# EAGLE design Trailer Wireup (EAGLE 9.6.2)
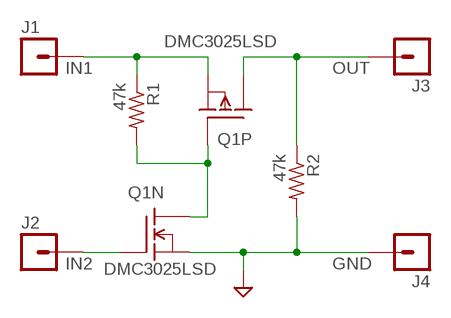
[diagram p0: schematic, sheet 1]

## Parts
J1  CONN-1-SCREW-#6-0.3IN  [SCREW_TERMINAL-#6-0.3IN]
J2  CONN-1-SCREW-#6-0.3IN  [SCREW_TERMINAL-#6-0.3IN]
J3  CONN-1-SCREW-#6-0.3IN  [SCREW_TERMINAL-#6-0.3IN]
J4  CONN-1-SCREW-#6-0.3IN  [SCREW_TERMINAL-#6-0.3IN]
Q1  DMC3025LSD  [SO8]
R1  47k  R-US0603  [0603]
R2  47k  R-US0603  [0603]

## Nets
GND: J4.1 Q1.1(N:S) R2.2
IN1: J1.1 Q1.3(P:S) R1.1
IN2: J2.1 Q1.2(N:G)
N$1: Q1.4(P:G) Q1.7(N:D) Q1.8(N:D) R1.2
OUT: J3.1 Q1.5(P:D) Q1.6(P:D) R2.1

## Library data of the parts
J1-J4 = Connectors:CONN-1
Q1 = Tim's Parts:DMC3025LSD
R1 R2 = Tim's Parts:R-US: RESISTOR, American symbol

## Board
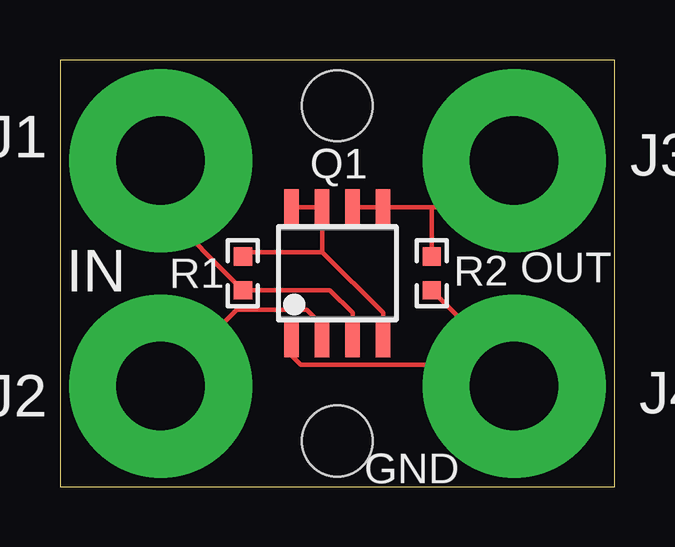
[diagram p1: board, top side]
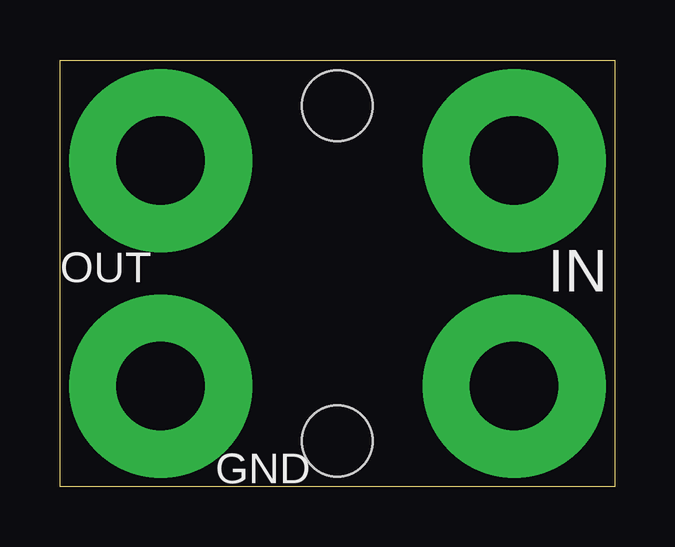
[diagram p2: board, bottom side, seen from below]

Size 23.11 x 17.78 mm. Coordinates in mm from the lower left corner, seen from the top.
Outline: 0,0 23.11,0 23.11,17.78 0,17.78 0,0
Copper layers (1*16): Top 0.035559375mm / dielectric 1.6mm / Bottom 0.035559375mm
Design rules "oshpark-2layer": minimum track width 6mil, minimum drill 10mil, track to track 6mil, track to pad 6mil, pad to pad 6mil, via to via 6mil, smd to smd 0mil, copper to edge 15mil, drill to drill 6mil, minimum pad ring 5mil, minimum via ring 5mil, stop-mask expansion 2.5mil, vias tented up to drill 0mil, thermal gap 6mil
Holes 2.95 mm at 11.56,15.88 11.56,1.91
tKeepout: area 8.8,13.1 to 14.4,18.7; area 8.8,-0.9 to 14.4,4.7

### Footprints (pad centres in the part's own frame; a part is rotated, then mirrored left to right if it is on the bottom)
SCREW_TERMINAL-#6-0.3IN = drill 3.683 pad 7.62: 1 0,0
SO8 = smd 0.6 x 1.5: 1 -1.905,-2.75; 2 -0.635,-2.75; 3 0.635,-2.75; 4 1.905,-2.75; 5 1.905,2.75; 6 0.635,2.75; 7 -0.635,2.75; 8 -1.905,2.75
0603 = smd 0.76 x 0.76: 1 -0.7,0; 2 0.7,0

### Placement (x,y rotation side)
J1  4.19,13.59 0 top
J2  4.19,4.19 0 top
J3  18.92,13.59 0 top
J4  18.92,4.19 0 top
Q1  11.56,8.89 0 top
R1  7.62,8.89 90 top
R2  15.49,8.89 270 top

### Tracks (layer width: path | path; a pad name or v marks a point on that pad's centre or on a via)
GND
  Top 0.178: Q1.1 9.65,5.46 10.03,5.08 18.03,5.08 18.86,4.25 | 18.86,4.25 J4.1 | R2.2 18.86,4.82 18.86,4.25
IN1
  Top 0.178: J1.1 4.19,11.62 R1.1 11.24,8.19 12.19,7.24 Q1.3
IN2
  Top 0.178: 10.92,5.97 Q1.2 10.92,6.73 10.29,7.37 7.37,7.37 J2.1
N$1
  Top 0.178: Q1.8 Q1.7 10.92,9.78 | 10.92,9.78 13.46,7.24 Q1.4 | R1.2 7.81,9.78 10.92,9.78
OUT
  Top 0.178: 15.49,11.64 Q1.5 Q1.6 | 15.49,11.64 16.97,11.64 J3.1 | R2.1 15.49,11.64

### Text on the board
tPlace: OUT | IN | GND
bPlace: OUT | IN | GND